# Altium schematic sheet Power.SchDoc: Power and Connector
size Letter; DrawnBy: Tony Liu; Organization: UW Robotics; Address1: 200 University Avenue; Address2: Waterloo; Address3: Ontario; Address4: Canada N2L 3G6; SheetNumber: 1; SheetTotal: 1; Time: 2020-05-07
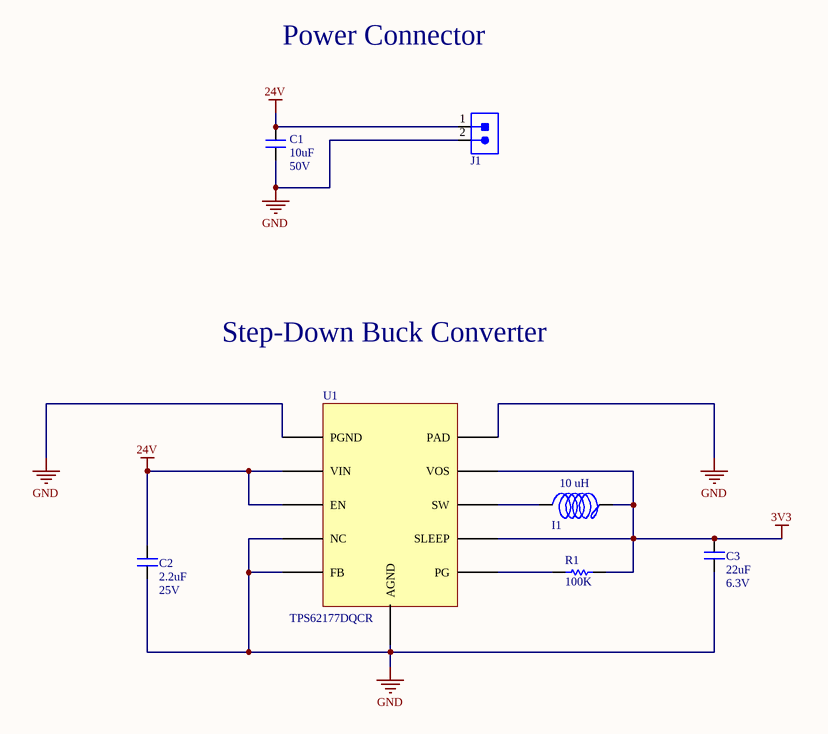
[diagram p0: Power.SchDoc]

## Parts
C1  Voltage Rating: 50V  [CAPC1206(3216)]  (hidden comment: 10uF)
C2  value 2.2uF  Voltage Rating: 25V  [CAPC2012X140N]  (hidden comment: CAP_2.2uF_25V_0805)
C3  value 22uF  Voltage Rating: 6.3V  [CAPC0603(1608)55_N]  (hidden comment: CAP_22uF_6.3V_0805)
I1  IND_10uH_6045  [IND_BOURNS_SRN6045]  (value not drawn)
J1  CON_2M_TERM  [1935161]  (value not drawn)
R1  value 100K  [RESC0603(1608)_N]  (hidden comment: RES_100K_0603)
U1  TPS62177DQCR  [DQC0010A]

## Nets
3V3: C3.2 I1.1 R1.1 U1.8(SLEEP) U1.10(VOS)
24V: C1.2 C2.2 J1.1 U1.2(VIN) U1.3(EN)
GND: C1.1 C2.1 C3.1 J1.2 U1.1(PGND) U1.4(NC) U1.5(FB) U1.6(AGND) U1.11(PAD)
NetI1_1: I1.1 U1.9(SW)
NetR1_2: R1.2 U1.7(PG)

## Notes on the sheet
- Power Connector
- Step-Down Buck Converter
- Title
- Size:
- Date:
- Letter
- Drawn By:
- Sheet
- of
- File:
- (in symbol IND_10uH_6045) 10 uH

## Library data of the parts
C1 = CAP_10uF_50V_1206: CAP CER 10UF 50V X5R 1206; Manufacturer Part Numer 1: GRT31CR61H106KE01L; Manufacturer 1: Murata; Dimensions: 0.126" L x 0.063" W (3.20mm x 1.6mm); Package: 1206 (3216 Metric); Supplier Part Number 1: 490-12456-1-ND; Supplier 1: Digi-Key; Mount: Surface Mount; Value: 10uF
C2 = CAP_2.2uF_25V_0805: CAP CER 2.2UF 25V X7R 0805; Manufacturer 1: Murata Electronics; Manufacturer Part Number 1: GRM21BR71E225KA73L; Capacitance: 2200nF; Tolerance: 10%; Mount: Surface Mount; Case/Package: 0805; Case Code (Metric): 2012; Case Code (Imperial): 0805; Min Operating Temperature: -55°C; Max Operating Temperature: 125°C; Dielectric: X7R; Termination: SMD/SMT; Length: 2mm; Height: 1.25mm; Width: 0.049inch; Thickness: 0.049inch; Depth: 1.25mm; Ratings: AEC-Q200; Supplier 1: Digi-Key; Supplier Part Number 1: 490-3331-2-ND
C3 = CAP_22uF_6.3V_0805: CAP CER 22UF 6.3V X5R 0805; Manufacturer 1: Murata Electronics; Manufacturer Part Number 1: GRM188R60J226MEA0D; Capacitance: 2200nF; Tolerance: 20%; Mount: Surface Mount; Case/Package: 0805; Case Code (Metric): 1608; Case Code (Imperial): 0603; Min Operating Temperature: -55°C; Max Operating Temperature: 85; Dielectric: X5R; Termination: SMD/SMT; Length: 1.6; Width: 0.031"; Thickness: 0.039inch; Depth: 1; Supplier 1: Digi-Key; Supplier Part Number 1: 490-7611-2-ND
I1 = IND_10uH_6045: IND WIRE 10 UH 6045; Manufacturer 1: Bourns Inc.; Manufacturer Part Number 1: SRN6045-100M; Supplier Part Number 1: SRN6045-100MTR-ND; Supplier 1: Digi-Key
J1 = CON_2M_TERM: TERM BLK 2POS SIDE ENTRY 5MM; Manufacturer 1: Phoenix Contact; Connector Type: Screw; Voltage Rating (DC): 320V; Max Current Rating: 16A; Max Supply Voltage: 250V; Current Rating: 17.5A; Number of Poles: 2; Number of Levels: 1; Current: 18A; Voltage: 300V; Wire Gauge (Max): 26AWG; Wire Gauge (Min): 12AWG; Approvals: UL; Supplier 1: Digi-Key; Manufacturer Part Number 1: 1935161; Stock 1: 15494; Pricing 1: 1=0.43000, 10=0.41100, 50=0.39280, 100=0.38200, 250=0.35700, 500=0.32844, 1000=0.30350 (USD); RoHS: Yes; Mount: Through Hole; Number of Pins: 2; Weight: 0.067021oz; Contact Material: Copper,Tin; Insulation Material: Nylon; Housing Material: Polyamide; Housing Color: Green; Color: Green; Material: Nylon; Number of Rows: 1; Voltage Rating: 250V; Package Quantity: 250; Packaging: Bulk; Number of Positions: 2; Number of Positions Per Level: 2; Termination: Solder; Number of Contacts: 2; Number of Circuits: 2; Orientation: Straight; Length: 9mm; Height: 11.3mm; Width: 14.9mm; Pitch: 5mm; Depth: 9mm; Wire/Cable Gauge: 26AWG; Radiation Hardening: No; Flammability Rating: UL94 V-0; Lead Free: Lead Free; REACH SVHC: Unknown; ComponentLink1URL: https://datasheet.ciiva.com/15169/getdatasheetpartid-177903-15169663.pdf?src-supplier=Verical; ComponentLink1Description: https://datasheet.ciiva.com/15169/getdatasheetpartid-177903-15169663.pdf?src-supplier=Verical; ComponentLink2URL: https://datasheet.ciiva.com/16047/1935161-16047247.pdf?src-supplier=Onlinecomponents.com; ComponentLink2Description: https://datasheet.ciiva.com/16047/1935161-16047247.pdf?src-supplier=Onlinecomponents.com; ComponentLink3URL: https://datasheet.ciiva.com/824/combiconcompact5-0mmseries-824222.pdf?src-supplier=Digi-Key; ComponentLink3Description: https://datasheet.ciiva.com/824/combiconcompact5-0mmseries-824222.pdf?src-supplier=Digi-Key; Supplier Part Number 1: 277-1667-ND
R1 = RES_100K_0603: RES SMD 100K OHM 5% 1/10W 0603; Manufacturer 1: Yageo; Manufacturer Part Number 1: RC0603FR-07261KL; Package: 0603 (1608 Metric); Dimensions: 0.063" L x 0.031" W (1.60mm x 0.80mm); Tolerance: 5%; Supplier Part Number 1: 311-261KHRCT-ND; Supplier 1: Digi-Key; Mount: Surface Mount
U1 = TPS62177DQCR: IC REG BUCK 3.3V 500MA 10WSON; Manufacturer 1: Texas Intruments; Supplier 1: Digi-Key; Supplier Part Number 1: 296-41856-1-ND; Manufacturer Part Number 1: TPS62177DQCR